# Altium schematic sheet MY_beamControl_R_对内接口.SchDoc
size A2; PageSetup: Record=PageOptions?CenterHorizontal=True?CenterVertical=True?PrintScale=0.73?XCorrection=1.00?YCorrection=1.00?PrintKind=1?BorderSize=5000000?LeftOffset=0?BottomOffset=0?Orientation=2?PaperLength=4200?PaperWidth=2970?Scale=100?PaperSource=7?PrintQuality=-4?MediaType=1?DitherType=10?PaperKind=A3?PrintScaleMode=1
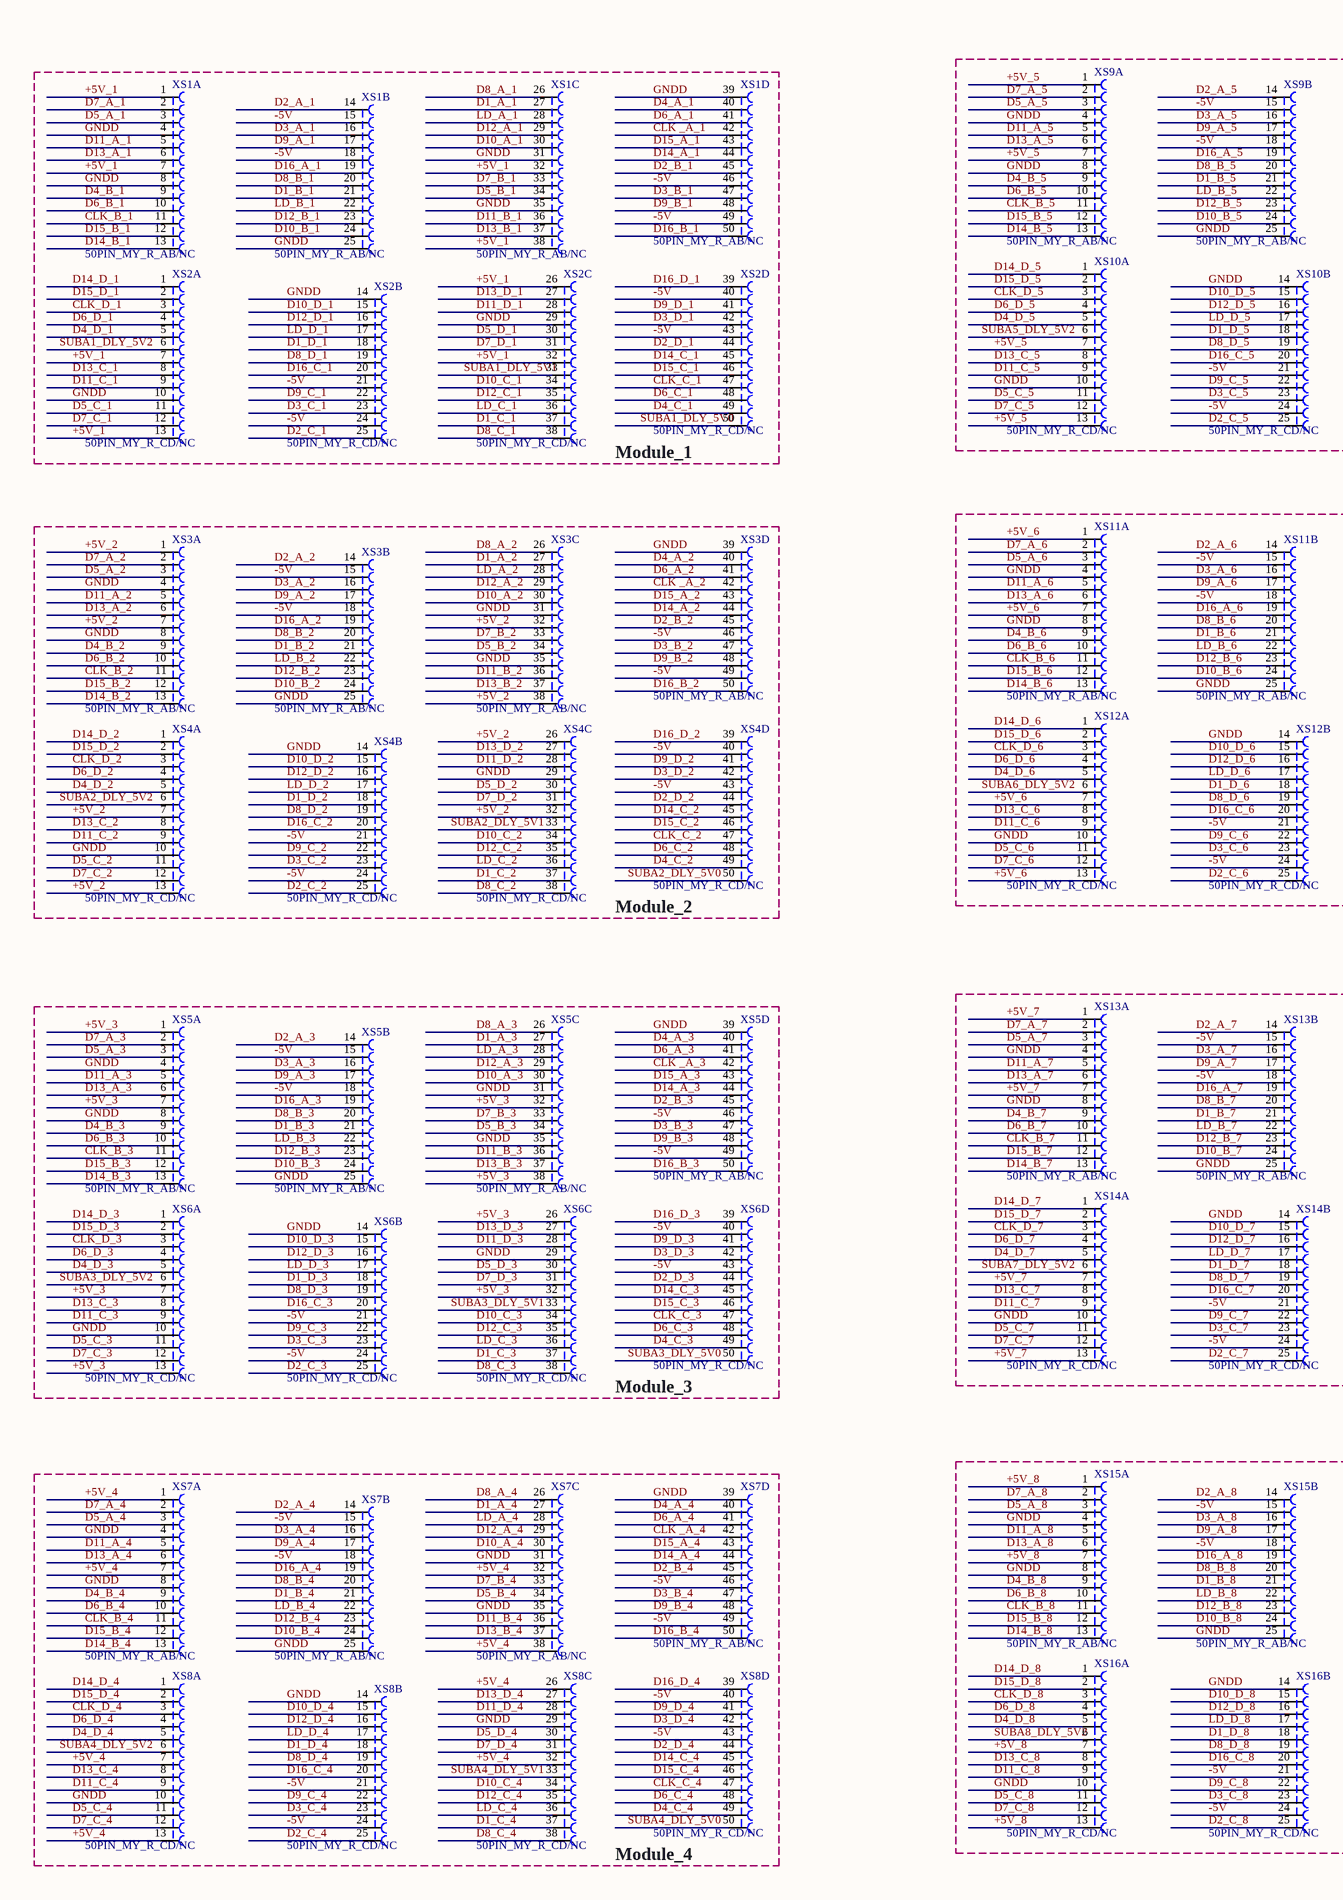
[diagram p0: MY_beamControl_R_对内接口.SchDoc, left]
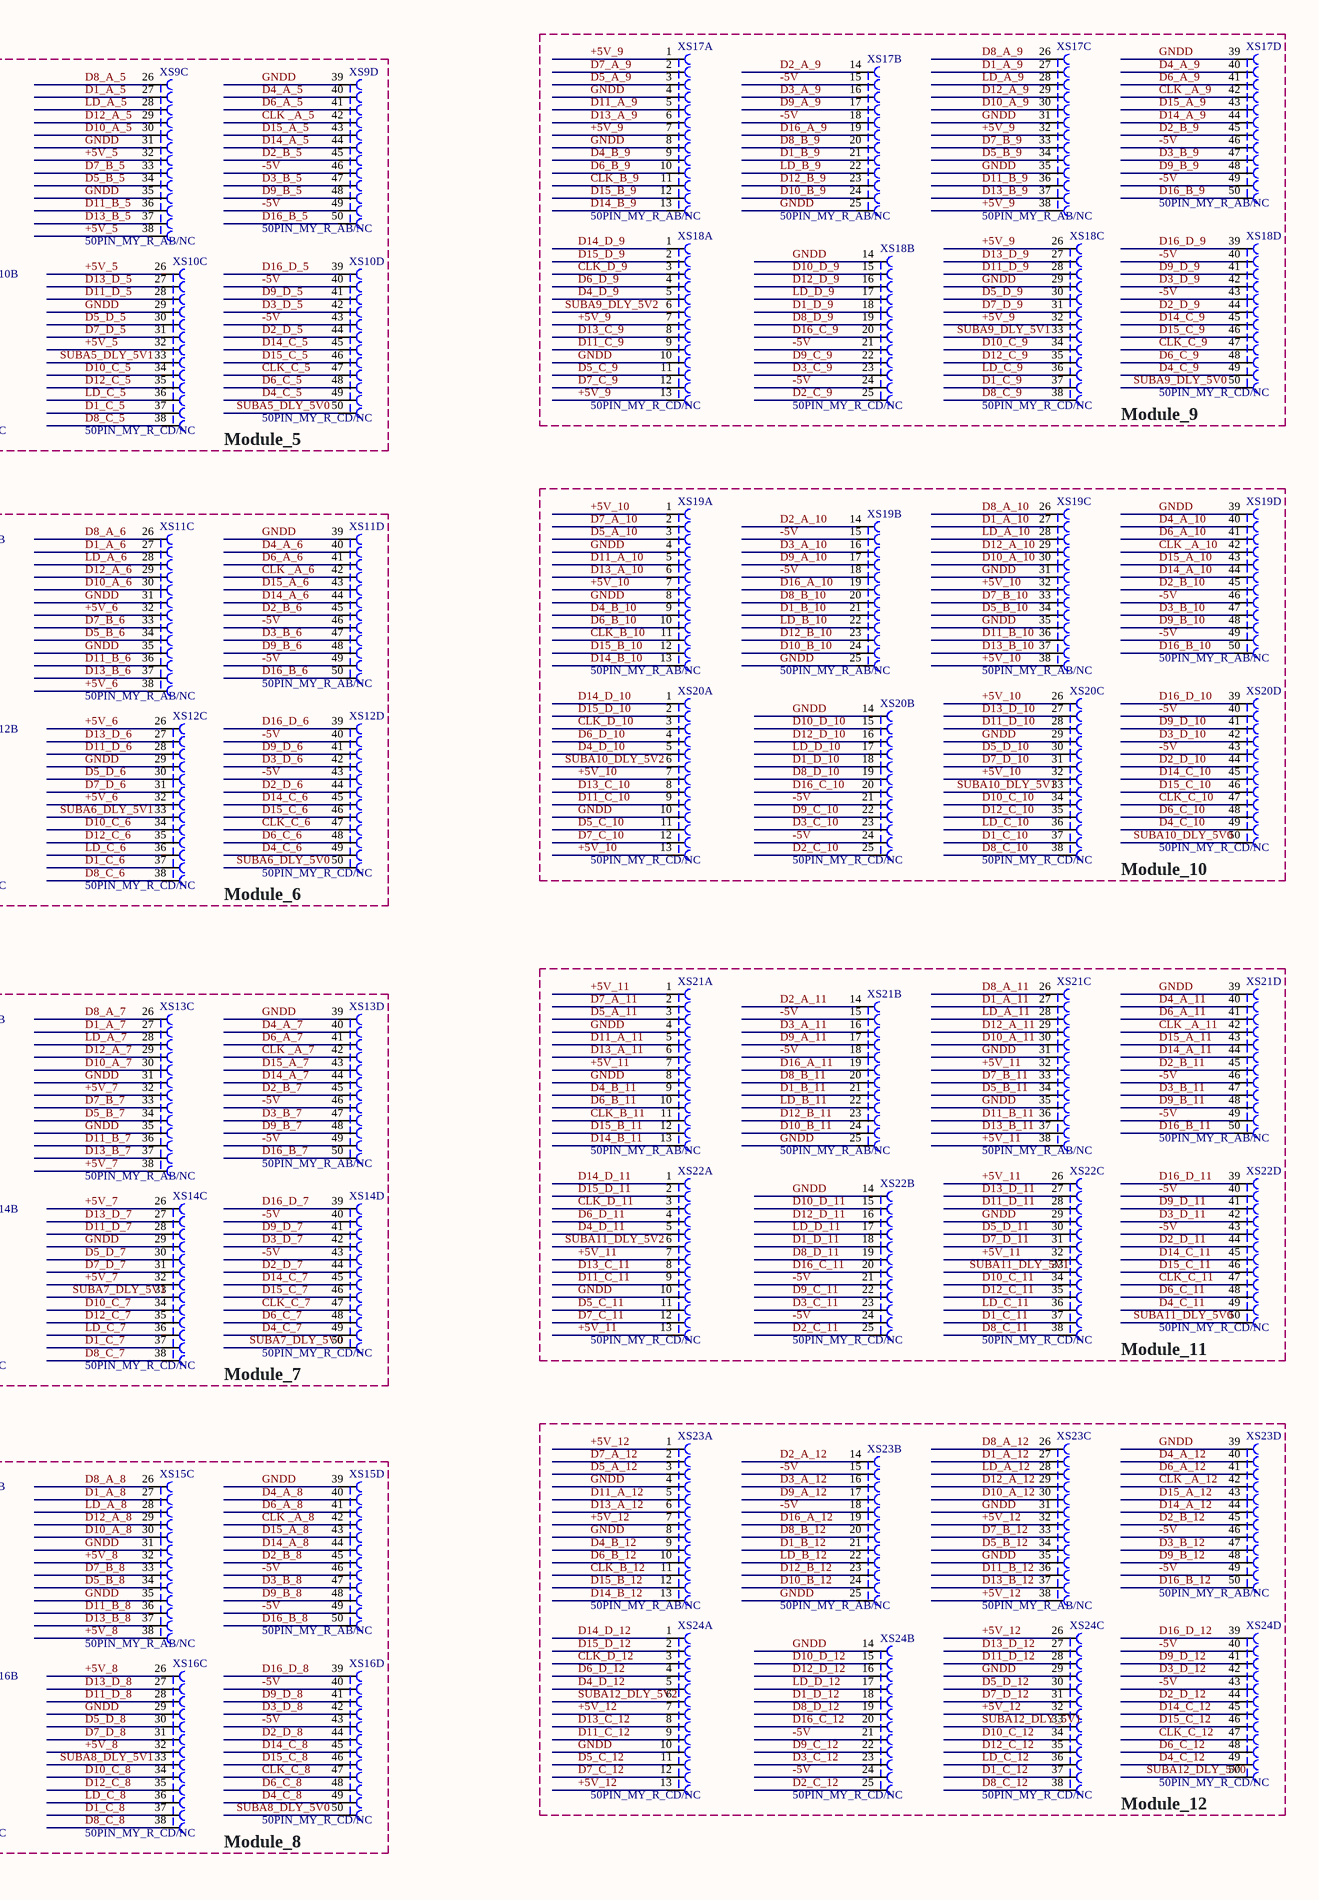
[diagram p1: MY_beamControl_R_对内接口.SchDoc, right]

## Parts
XS1  50PIN_MY_R_AB/NC  [PIN50_MY]  (parts A,B,C,D of 4)
XS2  50PIN_MY_R_CD/NC  [PIN50_MY]  (parts A,B,C,D of 4)
XS3  50PIN_MY_R_AB/NC  [PIN50_MY]  (parts A,B,C,D of 4)
XS4  50PIN_MY_R_CD/NC  [PIN50_MY]  (parts A,B,C,D of 4)
XS5  50PIN_MY_R_AB/NC  [PIN50_MY]  (parts A,B,C,D of 4)
XS6  50PIN_MY_R_CD/NC  [PIN50_MY]  (parts A,B,C,D of 4)
XS7  50PIN_MY_R_AB/NC  [PIN50_MY]  (parts A,B,C,D of 4)
XS8  50PIN_MY_R_CD/NC  [PIN50_MY]  (parts A,B,C,D of 4)
XS9  50PIN_MY_R_AB/NC  [PIN50_MY]  (parts A,B,C,D of 4)
XS10  50PIN_MY_R_CD/NC  [PIN50_MY]  (parts A,B,C,D of 4)
XS11  50PIN_MY_R_AB/NC  [PIN50_MY]  (parts A,B,C,D of 4)
XS12  50PIN_MY_R_CD/NC  [PIN50_MY]  (parts A,B,C,D of 4)
XS13  50PIN_MY_R_AB/NC  [PIN50_MY]  (parts A,B,C,D of 4)
XS14  50PIN_MY_R_CD/NC  [PIN50_MY]  (parts A,B,C,D of 4)
XS15  50PIN_MY_R_AB/NC  [PIN50_MY]  (parts A,B,C,D of 4)
XS16  50PIN_MY_R_CD/NC  [PIN50_MY]  (parts A,B,C,D of 4)
XS17  50PIN_MY_R_AB/NC  [PIN50_MY]  (parts A,B,C,D of 4)
XS18  50PIN_MY_R_CD/NC  [PIN50_MY]  (parts A,B,C,D of 4)
XS19  50PIN_MY_R_AB/NC  [PIN50_MY]  (parts A,B,C,D of 4)
XS20  50PIN_MY_R_CD/NC  [PIN50_MY]  (parts A,B,C,D of 4)
XS21  50PIN_MY_R_AB/NC  [PIN50_MY]  (parts A,B,C,D of 4)
XS22  50PIN_MY_R_CD/NC  [PIN50_MY]  (parts A,B,C,D of 4)
XS23  50PIN_MY_R_AB/NC  [PIN50_MY]  (parts A,B,C,D of 4)
XS24  50PIN_MY_R_CD/NC  [PIN50_MY]  (parts A,B,C,D of 4)

## Blocks framed on the sheet
Module_1: XS1 XS2
Module_5: XS9 XS10
Module_9: XS17 XS18
Module_6: XS11 XS12
Module_10: XS19 XS20
Module_2: XS3 XS4
Module_11: XS21 XS22
Module_3: XS5 XS6
Module_7: XS13 XS14
Module_12: XS23 XS24
Module_4: XS7 XS8
Module_8: XS15 XS16

## Nets
+5V_1: XS1.1 XS1.7 XS1.32 XS1.38 XS2.7 XS2.13 XS2.26 XS2.32
+5V_2: XS3.1 XS3.7 XS3.32 XS3.38 XS4.7 XS4.13 XS4.26 XS4.32
+5V_3: XS5.1 XS5.7 XS5.32 XS5.38 XS6.7 XS6.13 XS6.26 XS6.32
+5V_4: XS7.1 XS7.7 XS7.32 XS7.38 XS8.7 XS8.13 XS8.26 XS8.32
+5V_5: XS9.1 XS9.7 XS9.32 XS9.38 XS10.7 XS10.13 XS10.26 XS10.32
+5V_6: XS11.1 XS11.7 XS11.32 XS11.38 XS12.7 XS12.13 XS12.26 XS12.32
+5V_7: XS13.1 XS13.7 XS13.32 XS13.38 XS14.7 XS14.13 XS14.26 XS14.32
+5V_8: XS15.1 XS15.7 XS15.32 XS15.38 XS16.7 XS16.13 XS16.26 XS16.32
+5V_9: XS17.1 XS17.7 XS17.32 XS17.38 XS18.7 XS18.13 XS18.26 XS18.32
+5V_10: XS19.1 XS19.7 XS19.32 XS19.38 XS20.7 XS20.13 XS20.26 XS20.32
+5V_11: XS21.1 XS21.7 XS21.32 XS21.38 XS22.7 XS22.13 XS22.26 XS22.32
+5V_12: XS23.1 XS23.7 XS23.32 XS23.38 XS24.7 XS24.13 XS24.26 XS24.32
-5V: XS1.15 XS1.18 XS1.46 XS1.49 XS2.21 XS2.24 XS2.40 XS2.43 XS3.15 XS3.18 XS3.46 XS3.49 XS4.21 XS4.24 XS4.40 XS4.43 XS5.15 XS5.18 XS5.46 XS5.49 XS6.21 XS6.24 XS6.40 XS6.43 XS7.15 XS7.18 XS7.46 XS7.49 XS8.21 XS8.24 XS8.40 XS8.43 XS9.15 XS9.18 XS9.46 XS9.49 XS10.21 XS10.24 XS10.40 XS10.43 XS11.15 XS11.18 XS11.46 XS11.49 XS12.21 XS12.24 XS12.40 XS12.43 XS13.15 XS13.18 XS13.46 XS13.49 XS14.21 XS14.24 XS14.40 XS14.43 XS15.15 XS15.18 XS15.46 XS15.49 XS16.21 XS16.24 XS16.40 XS16.43 XS17.15 XS17.18 XS17.46 XS17.49 XS18.21 XS18.24 XS18.40 XS18.43 XS19.15 XS19.18 XS19.46 XS19.49 XS20.21 XS20.24 XS20.40 XS20.43 XS21.15 XS21.18 XS21.46 XS21.49 XS22.21 XS22.24 XS22.40 XS22.43 XS23.15 XS23.18 XS23.46 XS23.49 XS24.21 XS24.24 XS24.40 XS24.43
CLK _A_1: XS1.42
CLK _A_2: XS3.42
CLK _A_3: XS5.42
CLK _A_4: XS7.42
CLK _A_5: XS9.42
CLK _A_6: XS11.42
CLK _A_7: XS13.42
CLK _A_8: XS15.42
CLK _A_9: XS17.42
CLK _A_10: XS19.42
CLK _A_11: XS21.42
CLK _A_12: XS23.42
CLK_B_1: XS1.11
CLK_B_2: XS3.11
CLK_B_3: XS5.11
CLK_B_4: XS7.11
CLK_B_5: XS9.11
CLK_B_6: XS11.11
CLK_B_7: XS13.11
CLK_B_8: XS15.11
CLK_B_9: XS17.11
CLK_B_10: XS19.11
CLK_B_11: XS21.11
CLK_B_12: XS23.11
CLK_C_1: XS2.47
CLK_C_2: XS4.47
CLK_C_3: XS6.47
CLK_C_4: XS8.47
CLK_C_5: XS10.47
CLK_C_6: XS12.47
CLK_C_7: XS14.47
CLK_C_8: XS16.47
CLK_C_9: XS18.47
CLK_C_10: XS20.47
CLK_C_11: XS22.47
CLK_C_12: XS24.47
CLK_D_1: XS2.3
CLK_D_2: XS4.3
CLK_D_3: XS6.3
CLK_D_4: XS8.3
CLK_D_5: XS10.3
CLK_D_6: XS12.3
CLK_D_7: XS14.3
CLK_D_8: XS16.3
CLK_D_9: XS18.3
CLK_D_10: XS20.3
CLK_D_11: XS22.3
CLK_D_12: XS24.3
D1_A_1: XS1.27
D1_A_2: XS3.27
D1_A_3: XS5.27
D1_A_4: XS7.27
D1_A_5: XS9.27
D1_A_6: XS11.27
D1_A_7: XS13.27
D1_A_8: XS15.27
D1_A_9: XS17.27
D1_A_10: XS19.27
D1_A_11: XS21.27
D1_A_12: XS23.27
D1_B_1: XS1.21
D1_B_2: XS3.21
D1_B_3: XS5.21
D1_B_4: XS7.21
D1_B_5: XS9.21
D1_B_6: XS11.21
D1_B_7: XS13.21
D1_B_8: XS15.21
D1_B_9: XS17.21
D1_B_10: XS19.21
D1_B_11: XS21.21
D1_B_12: XS23.21
D1_C_1: XS2.37
D1_C_2: XS4.37
D1_C_3: XS6.37
D1_C_4: XS8.37
D1_C_5: XS10.37
D1_C_6: XS12.37
D1_C_7: XS14.37
D1_C_8: XS16.37
D1_C_9: XS18.37
D1_C_10: XS20.37
D1_C_11: XS22.37
D1_C_12: XS24.37
D1_D_1: XS2.18
D1_D_2: XS4.18
D1_D_3: XS6.18
D1_D_4: XS8.18
D1_D_5: XS10.18
D1_D_6: XS12.18
D1_D_7: XS14.18
D1_D_8: XS16.18
D1_D_9: XS18.18
D1_D_10: XS20.18
D1_D_11: XS22.18
D1_D_12: XS24.18
D2_A_1: XS1.14
D2_A_2: XS3.14
D2_A_3: XS5.14
D2_A_4: XS7.14
D2_A_5: XS9.14
D2_A_6: XS11.14
D2_A_7: XS13.14
D2_A_8: XS15.14
D2_A_9: XS17.14
D2_A_10: XS19.14
D2_A_11: XS21.14
D2_A_12: XS23.14
D2_B_1: XS1.45
D2_B_2: XS3.45
D2_B_3: XS5.45
D2_B_4: XS7.45
D2_B_5: XS9.45
D2_B_6: XS11.45
D2_B_7: XS13.45
D2_B_8: XS15.45
D2_B_9: XS17.45
D2_B_10: XS19.45
D2_B_11: XS21.45
D2_B_12: XS23.45
D2_C_1: XS2.25
D2_C_2: XS4.25
D2_C_3: XS6.25
D2_C_4: XS8.25
D2_C_5: XS10.25
D2_C_6: XS12.25
D2_C_7: XS14.25
D2_C_8: XS16.25
D2_C_9: XS18.25
D2_C_10: XS20.25
D2_C_11: XS22.25
D2_C_12: XS24.25
D2_D_1: XS2.44
D2_D_2: XS4.44
D2_D_3: XS6.44
D2_D_4: XS8.44
D2_D_5: XS10.44
D2_D_6: XS12.44
D2_D_7: XS14.44
D2_D_8: XS16.44
D2_D_9: XS18.44
D2_D_10: XS20.44
D2_D_11: XS22.44
D2_D_12: XS24.44
D3_A_1: XS1.16
D3_A_2: XS3.16
D3_A_3: XS5.16
D3_A_4: XS7.16
D3_A_5: XS9.16
D3_A_6: XS11.16
D3_A_7: XS13.16
D3_A_8: XS15.16
D3_A_9: XS17.16
D3_A_10: XS19.16
D3_A_11: XS21.16
D3_A_12: XS23.16
D3_B_1: XS1.47
D3_B_2: XS3.47
D3_B_3: XS5.47
D3_B_4: XS7.47
D3_B_5: XS9.47
D3_B_6: XS11.47
D3_B_7: XS13.47
D3_B_8: XS15.47
D3_B_9: XS17.47
D3_B_10: XS19.47
D3_B_11: XS21.47
D3_B_12: XS23.47
D3_C_1: XS2.23
D3_C_2: XS4.23
D3_C_3: XS6.23
D3_C_4: XS8.23
D3_C_5: XS10.23
D3_C_6: XS12.23
D3_C_7: XS14.23
D3_C_8: XS16.23
D3_C_9: XS18.23
D3_C_10: XS20.23
D3_C_11: XS22.23
D3_C_12: XS24.23
D3_D_1: XS2.42
D3_D_2: XS4.42
D3_D_3: XS6.42
D3_D_4: XS8.42
D3_D_5: XS10.42
D3_D_6: XS12.42
D3_D_7: XS14.42
D3_D_8: XS16.42
D3_D_9: XS18.42
D3_D_10: XS20.42
D3_D_11: XS22.42
D3_D_12: XS24.42
D4_A_1: XS1.40
D4_A_2: XS3.40
D4_A_3: XS5.40
D4_A_4: XS7.40
D4_A_5: XS9.40
D4_A_6: XS11.40
D4_A_7: XS13.40
D4_A_8: XS15.40
D4_A_9: XS17.40
D4_A_10: XS19.40
D4_A_11: XS21.40
D4_A_12: XS23.40
D4_B_1: XS1.9
D4_B_2: XS3.9
D4_B_3: XS5.9
D4_B_4: XS7.9
D4_B_5: XS9.9
D4_B_6: XS11.9
D4_B_7: XS13.9
D4_B_8: XS15.9
D4_B_9: XS17.9
D4_B_10: XS19.9
D4_B_11: XS21.9
D4_B_12: XS23.9
D4_C_1: XS2.49
D4_C_2: XS4.49
D4_C_3: XS6.49
D4_C_4: XS8.49
D4_C_5: XS10.49
D4_C_6: XS12.49
D4_C_7: XS14.49
D4_C_8: XS16.49
D4_C_9: XS18.49
D4_C_10: XS20.49
D4_C_11: XS22.49
D4_C_12: XS24.49
D4_D_1: XS2.5
D4_D_2: XS4.5
D4_D_3: XS6.5
D4_D_4: XS8.5
D4_D_5: XS10.5
D4_D_6: XS12.5
D4_D_7: XS14.5
D4_D_8: XS16.5
D4_D_9: XS18.5
D4_D_10: XS20.5
D4_D_11: XS22.5
D4_D_12: XS24.5
D5_A_1: XS1.3
D5_A_2: XS3.3
D5_A_3: XS5.3
D5_A_4: XS7.3
D5_A_5: XS9.3
D5_A_6: XS11.3
D5_A_7: XS13.3
D5_A_8: XS15.3
D5_A_9: XS17.3
D5_A_10: XS19.3
D5_A_11: XS21.3
D5_A_12: XS23.3
D5_B_1: XS1.34
D5_B_2: XS3.34
D5_B_3: XS5.34
D5_B_4: XS7.34
D5_B_5: XS9.34
D5_B_6: XS11.34
D5_B_7: XS13.34
D5_B_8: XS15.34
D5_B_9: XS17.34
D5_B_10: XS19.34
D5_B_11: XS21.34
D5_B_12: XS23.34
D5_C_1: XS2.11
D5_C_2: XS4.11
D5_C_3: XS6.11
D5_C_4: XS8.11
D5_C_5: XS10.11
D5_C_6: XS12.11
D5_C_7: XS14.11
D5_C_8: XS16.11
D5_C_9: XS18.11
D5_C_10: XS20.11
D5_C_11: XS22.11
D5_C_12: XS24.11
D5_D_1: XS2.30
D5_D_2: XS4.30
D5_D_3: XS6.30
D5_D_4: XS8.30
D5_D_5: XS10.30
D5_D_6: XS12.30
D5_D_7: XS14.30
D5_D_8: XS16.30
D5_D_9: XS18.30
D5_D_10: XS20.30
D5_D_11: XS22.30
D5_D_12: XS24.30
D6_A_1: XS1.41
D6_A_2: XS3.41
D6_A_3: XS5.41
D6_A_4: XS7.41
D6_A_5: XS9.41
D6_A_6: XS11.41
D6_A_7: XS13.41
D6_A_8: XS15.41
D6_A_9: XS17.41
D6_A_10: XS19.41
D6_A_11: XS21.41
D6_A_12: XS23.41
D6_B_1: XS1.10
D6_B_2: XS3.10
D6_B_3: XS5.10
D6_B_4: XS7.10
D6_B_5: XS9.10
D6_B_6: XS11.10
D6_B_7: XS13.10
D6_B_8: XS15.10
D6_B_9: XS17.10
D6_B_10: XS19.10
D6_B_11: XS21.10
D6_B_12: XS23.10
D6_C_1: XS2.48
D6_C_2: XS4.48
D6_C_3: XS6.48
D6_C_4: XS8.48
D6_C_5: XS10.48
D6_C_6: XS12.48
D6_C_7: XS14.48
D6_C_8: XS16.48
D6_C_9: XS18.48
D6_C_10: XS20.48
D6_C_11: XS22.48
D6_C_12: XS24.48
D6_D_1: XS2.4
D6_D_2: XS4.4
D6_D_3: XS6.4
D6_D_4: XS8.4
D6_D_5: XS10.4
D6_D_6: XS12.4
D6_D_7: XS14.4
D6_D_8: XS16.4
D6_D_9: XS18.4
D6_D_10: XS20.4
D6_D_11: XS22.4
D6_D_12: XS24.4
D7_A_1: XS1.2
D7_A_2: XS3.2
D7_A_3: XS5.2
D7_A_4: XS7.2
D7_A_5: XS9.2
D7_A_6: XS11.2
D7_A_7: XS13.2
D7_A_8: XS15.2
D7_A_9: XS17.2
D7_A_10: XS19.2
D7_A_11: XS21.2
D7_A_12: XS23.2
D7_B_1: XS1.33
D7_B_2: XS3.33
D7_B_3: XS5.33
D7_B_4: XS7.33
D7_B_5: XS9.33
D7_B_6: XS11.33
D7_B_7: XS13.33
D7_B_8: XS15.33
D7_B_9: XS17.33
D7_B_10: XS19.33
D7_B_11: XS21.33
D7_B_12: XS23.33
D7_C_1: XS2.12
D7_C_2: XS4.12
D7_C_3: XS6.12
D7_C_4: XS8.12
D7_C_5: XS10.12
D7_C_6: XS12.12
D7_C_7: XS14.12
D7_C_8: XS16.12
D7_C_9: XS18.12
D7_C_10: XS20.12
D7_C_11: XS22.12
D7_C_12: XS24.12
D7_D_1: XS2.31
D7_D_2: XS4.31
D7_D_3: XS6.31
D7_D_4: XS8.31
D7_D_5: XS10.31
D7_D_6: XS12.31
D7_D_7: XS14.31
D7_D_8: XS16.31
D7_D_9: XS18.31
D7_D_10: XS20.31
D7_D_11: XS22.31
D7_D_12: XS24.31
D8_A_1: XS1.26
D8_A_2: XS3.26
D8_A_3: XS5.26
D8_A_4: XS7.26
D8_A_5: XS9.26
D8_A_6: XS11.26
D8_A_7: XS13.26
D8_A_8: XS15.26
D8_A_9: XS17.26
D8_A_10: XS19.26
D8_A_11: XS21.26
D8_A_12: XS23.26
D8_B_1: XS1.20
D8_B_2: XS3.20
D8_B_3: XS5.20
D8_B_4: XS7.20
D8_B_5: XS9.20
D8_B_6: XS11.20
D8_B_7: XS13.20
D8_B_8: XS15.20
D8_B_9: XS17.20
D8_B_10: XS19.20
D8_B_11: XS21.20
D8_B_12: XS23.20
D8_C_1: XS2.38
D8_C_2: XS4.38
D8_C_3: XS6.38
D8_C_4: XS8.38
D8_C_5: XS10.38
D8_C_6: XS12.38
D8_C_7: XS14.38
D8_C_8: XS16.38
D8_C_9: XS18.38
D8_C_10: XS20.38
D8_C_11: XS22.38
D8_C_12: XS24.38
D8_D_1: XS2.19
D8_D_2: XS4.19
D8_D_3: XS6.19
D8_D_4: XS8.19
D8_D_5: XS10.19
D8_D_6: XS12.19
D8_D_7: XS14.19
D8_D_8: XS16.19
D8_D_9: XS18.19
D8_D_10: XS20.19
D8_D_11: XS22.19
D8_D_12: XS24.19
D9_A_1: XS1.17
D9_A_2: XS3.17
D9_A_3: XS5.17
D9_A_4: XS7.17
D9_A_5: XS9.17
D9_A_6: XS11.17
D9_A_7: XS13.17
D9_A_8: XS15.17
D9_A_9: XS17.17
D9_A_10: XS19.17
D9_A_11: XS21.17
D9_A_12: XS23.17
D9_B_1: XS1.48
D9_B_2: XS3.48
D9_B_3: XS5.48
D9_B_4: XS7.48
D9_B_5: XS9.48
D9_B_6: XS11.48
D9_B_7: XS13.48
D9_B_8: XS15.48
D9_B_9: XS17.48
D9_B_10: XS19.48
D9_B_11: XS21.48
D9_B_12: XS23.48
D9_C_1: XS2.22
D9_C_2: XS4.22
D9_C_3: XS6.22
D9_C_4: XS8.22
D9_C_5: XS10.22
D9_C_6: XS12.22
D9_C_7: XS14.22
D9_C_8: XS16.22
D9_C_9: XS18.22
D9_C_10: XS20.22
D9_C_11: XS22.22
D9_C_12: XS24.22
D9_D_1: XS2.41
D9_D_2: XS4.41
D9_D_3: XS6.41
D9_D_4: XS8.41
D9_D_5: XS10.41
D9_D_6: XS12.41
D9_D_7: XS14.41
D9_D_8: XS16.41
D9_D_9: XS18.41
D9_D_10: XS20.41
D9_D_11: XS22.41
D9_D_12: XS24.41
D10_A_1: XS1.30
D10_A_2: XS3.30
D10_A_3: XS5.30
D10_A_4: XS7.30
D10_A_5: XS9.30
D10_A_6: XS11.30
D10_A_7: XS13.30
D10_A_8: XS15.30
D10_A_9: XS17.30
D10_A_10: XS19.30
D10_A_11: XS21.30
D10_A_12: XS23.30
D10_B_1: XS1.24
D10_B_2: XS3.24
D10_B_3: XS5.24
D10_B_4: XS7.24
D10_B_5: XS9.24
D10_B_6: XS11.24
D10_B_7: XS13.24
D10_B_8: XS15.24
D10_B_9: XS17.24
D10_B_10: XS19.24
D10_B_11: XS21.24
D10_B_12: XS23.24
D10_C_1: XS2.34
D10_C_2: XS4.34
D10_C_3: XS6.34
D10_C_4: XS8.34
D10_C_5: XS10.34
D10_C_6: XS12.34
D10_C_7: XS14.34
D10_C_8: XS16.34
D10_C_9: XS18.34
D10_C_10: XS20.34
D10_C_11: XS22.34
D10_C_12: XS24.34
D10_D_1: XS2.15
D10_D_2: XS4.15
D10_D_3: XS6.15
D10_D_4: XS8.15
D10_D_5: XS10.15
D10_D_6: XS12.15
D10_D_7: XS14.15
D10_D_8: XS16.15
D10_D_9: XS18.15
D10_D_10: XS20.15
D10_D_11: XS22.15
D10_D_12: XS24.15
D11_A_1: XS1.5
D11_A_2: XS3.5
D11_A_3: XS5.5
D11_A_4: XS7.5
D11_A_5: XS9.5
D11_A_6: XS11.5
D11_A_7: XS13.5
D11_A_8: XS15.5
D11_A_9: XS17.5
D11_A_10: XS19.5
D11_A_11: XS21.5
D11_A_12: XS23.5
D11_B_1: XS1.36
D11_B_2: XS3.36
D11_B_3: XS5.36
D11_B_4: XS7.36
D11_B_5: XS9.36
D11_B_6: XS11.36
D11_B_7: XS13.36
D11_B_8: XS15.36
D11_B_9: XS17.36
D11_B_10: XS19.36
D11_B_11: XS21.36
D11_B_12: XS23.36
D11_C_1: XS2.9
D11_C_2: XS4.9
D11_C_3: XS6.9
D11_C_4: XS8.9
D11_C_5: XS10.9
D11_C_6: XS12.9
D11_C_7: XS14.9
D11_C_8: XS16.9
D11_C_9: XS18.9
D11_C_10: XS20.9
D11_C_11: XS22.9
D11_C_12: XS24.9
D11_D_1: XS2.28
D11_D_2: XS4.28
D11_D_3: XS6.28
D11_D_4: XS8.28
D11_D_5: XS10.28
D11_D_6: XS12.28
D11_D_7: XS14.28
D11_D_8: XS16.28
D11_D_9: XS18.28
D11_D_10: XS20.28
D11_D_11: XS22.28
D11_D_12: XS24.28
D12_A_1: XS1.29
D12_A_2: XS3.29
D12_A_3: XS5.29
D12_A_4: XS7.29
D12_A_5: XS9.29
D12_A_6: XS11.29
D12_A_7: XS13.29
D12_A_8: XS15.29
D12_A_9: XS17.29
D12_A_10: XS19.29
D12_A_11: XS21.29
D12_A_12: XS23.29
D12_B_1: XS1.23
D12_B_2: XS3.23
D12_B_3: XS5.23
D12_B_4: XS7.23
D12_B_5: XS9.23
D12_B_6: XS11.23
D12_B_7: XS13.23
D12_B_8: XS15.23
D12_B_9: XS17.23
D12_B_10: XS19.23
D12_B_11: XS21.23
D12_B_12: XS23.23
D12_C_1: XS2.35
D12_C_2: XS4.35
D12_C_3: XS6.35
D12_C_4: XS8.35
D12_C_5: XS10.35
D12_C_6: XS12.35
D12_C_7: XS14.35
D12_C_8: XS16.35
D12_C_9: XS18.35
D12_C_10: XS20.35
D12_C_11: XS22.35
D12_C_12: XS24.35
D12_D_1: XS2.16
D12_D_2: XS4.16
D12_D_3: XS6.16
D12_D_4: XS8.16
D12_D_5: XS10.16
D12_D_6: XS12.16
D12_D_7: XS14.16
D12_D_8: XS16.16
D12_D_9: XS18.16
D12_D_10: XS20.16
D12_D_11: XS22.16
D12_D_12: XS24.16
D13_A_1: XS1.6
D13_A_2: XS3.6
D13_A_3: XS5.6
D13_A_4: XS7.6
D13_A_5: XS9.6
D13_A_6: XS11.6
D13_A_7: XS13.6
D13_A_8: XS15.6
D13_A_9: XS17.6
D13_A_10: XS19.6
D13_A_11: XS21.6
D13_A_12: XS23.6
D13_B_1: XS1.37
D13_B_2: XS3.37
D13_B_3: XS5.37
D13_B_4: XS7.37
D13_B_5: XS9.37
D13_B_6: XS11.37
D13_B_7: XS13.37
D13_B_8: XS15.37
D13_B_9: XS17.37
D13_B_10: XS19.37
D13_B_11: XS21.37
D13_B_12: XS23.37
D13_C_1: XS2.8
D13_C_2: XS4.8
D13_C_3: XS6.8
D13_C_4: XS8.8
D13_C_5: XS10.8
D13_C_6: XS12.8
D13_C_7: XS14.8
D13_C_8: XS16.8
D13_C_9: XS18.8
D13_C_10: XS20.8
D13_C_11: XS22.8
D13_C_12: XS24.8
D13_D_1: XS2.27
D13_D_2: XS4.27
D13_D_3: XS6.27
D13_D_4: XS8.27
D13_D_5: XS10.27
D13_D_6: XS12.27
D13_D_7: XS14.27
D13_D_8: XS16.27
D13_D_9: XS18.27
D13_D_10: XS20.27
D13_D_11: XS22.27
D13_D_12: XS24.27
D14_A_1: XS1.44
D14_A_2: XS3.44
D14_A_3: XS5.44
D14_A_4: XS7.44
D14_A_5: XS9.44
D14_A_6: XS11.44
D14_A_7: XS13.44
D14_A_8: XS15.44
D14_A_9: XS17.44
D14_A_10: XS19.44
D14_A_11: XS21.44
D14_A_12: XS23.44
D14_B_1: XS1.13
D14_B_2: XS3.13
D14_B_3: XS5.13
D14_B_4: XS7.13
D14_B_5: XS9.13
D14_B_6: XS11.13
D14_B_7: XS13.13
D14_B_8: XS15.13
D14_B_9: XS17.13
D14_B_10: XS19.13
D14_B_11: XS21.13
D14_B_12: XS23.13
D14_C_1: XS2.45
D14_C_2: XS4.45
D14_C_3: XS6.45
D14_C_4: XS8.45
D14_C_5: XS10.45
D14_C_6: XS12.45
D14_C_7: XS14.45
D14_C_8: XS16.45
D14_C_9: XS18.45
D14_C_10: XS20.45
D14_C_11: XS22.45
D14_C_12: XS24.45
D14_D_1: XS2.1
D14_D_2: XS4.1
D14_D_3: XS6.1
D14_D_4: XS8.1
D14_D_5: XS10.1
D14_D_6: XS12.1
D14_D_7: XS14.1
D14_D_8: XS16.1
D14_D_9: XS18.1
D14_D_10: XS20.1
D14_D_11: XS22.1
D14_D_12: XS24.1
D15_A_1: XS1.43
D15_A_2: XS3.43
D15_A_3: XS5.43
D15_A_4: XS7.43
D15_A_5: XS9.43
D15_A_6: XS11.43
D15_A_7: XS13.43
D15_A_8: XS15.43
D15_A_9: XS17.43
D15_A_10: XS19.43
D15_A_11: XS21.43
D15_A_12: XS23.43
D15_B_1: XS1.12
D15_B_2: XS3.12
D15_B_3: XS5.12
D15_B_4: XS7.12
D15_B_5: XS9.12
D15_B_6: XS11.12
D15_B_7: XS13.12
D15_B_8: XS15.12
D15_B_9: XS17.12
D15_B_10: XS19.12
D15_B_11: XS21.12
D15_B_12: XS23.12
D15_C_1: XS2.46
D15_C_2: XS4.46
D15_C_3: XS6.46
D15_C_4: XS8.46
D15_C_5: XS10.46
D15_C_6: XS12.46
D15_C_7: XS14.46
D15_C_8: XS16.46
D15_C_9: XS18.46
D15_C_10: XS20.46
D15_C_11: XS22.46
D15_C_12: XS24.46
D15_D_1: XS2.2
D15_D_2: XS4.2
D15_D_3: XS6.2
D15_D_4: XS8.2
D15_D_5: XS10.2
D15_D_6: XS12.2
D15_D_7: XS14.2
D15_D_8: XS16.2
D15_D_9: XS18.2
D15_D_10: XS20.2
D15_D_11: XS22.2
D15_D_12: XS24.2
D16_A_1: XS1.19
D16_A_2: XS3.19
D16_A_3: XS5.19
D16_A_4: XS7.19
D16_A_5: XS9.19
D16_A_6: XS11.19
D16_A_7: XS13.19
D16_A_8: XS15.19
D16_A_9: XS17.19
D16_A_10: XS19.19
D16_A_11: XS21.19
D16_A_12: XS23.19
D16_B_1: XS1.50
D16_B_2: XS3.50
D16_B_3: XS5.50
D16_B_4: XS7.50
D16_B_5: XS9.50
D16_B_6: XS11.50
D16_B_7: XS13.50
D16_B_8: XS15.50
D16_B_9: XS17.50
D16_B_10: XS19.50
D16_B_11: XS21.50
D16_B_12: XS23.50
D16_C_1: XS2.20
D16_C_2: XS4.20
D16_C_3: XS6.20
D16_C_4: XS8.20
D16_C_5: XS10.20
D16_C_6: XS12.20
D16_C_7: XS14.20
D16_C_8: XS16.20
D16_C_9: XS18.20
D16_C_10: XS20.20
D16_C_11: XS22.20
D16_C_12: XS24.20
D16_D_1: XS2.39
D16_D_2: XS4.39
D16_D_3: XS6.39
D16_D_4: XS8.39
D16_D_5: XS10.39
D16_D_6: XS12.39
D16_D_7: XS14.39
D16_D_8: XS16.39
D16_D_9: XS18.39
D16_D_10: XS20.39
D16_D_11: XS22.39
D16_D_12: XS24.39
GNDD: XS1.4 XS1.8 XS1.25 XS1.31 XS1.35 XS1.39 XS2.10 XS2.14 XS2.29 XS3.4 XS3.8 XS3.25 XS3.31 XS3.35 XS3.39 XS4.10 XS4.14 XS4.29 XS5.4 XS5.8 XS5.25 XS5.31 XS5.35 XS5.39 XS6.10 XS6.14 XS6.29 XS7.4 XS7.8 XS7.25 XS7.31 XS7.35 XS7.39 XS8.10 XS8.14 XS8.29 XS9.4 XS9.8 XS9.25 XS9.31 XS9.35 XS9.39 XS10.10 XS10.14 XS10.29 XS11.4 XS11.8 XS11.25 XS11.31 XS11.35 XS11.39 XS12.10 XS12.14 XS12.29 XS13.4 XS13.8 XS13.25 XS13.31 XS13.35 XS13.39 XS14.10 XS14.14 XS14.29 XS15.4 XS15.8 XS15.25 XS15.31 XS15.35 XS15.39 XS16.10 XS16.14 XS16.29 XS17.4 XS17.8 XS17.25 XS17.31 XS17.35 XS17.39 XS18.10 XS18.14 XS18.29 XS19.4 XS19.8 XS19.25 XS19.31 XS19.35 XS19.39 XS20.10 XS20.14 XS20.29 XS21.4 XS21.8 XS21.25 XS21.31 XS21.35 XS21.39 XS22.10 XS22.14 XS22.29 XS23.4 XS23.8 XS23.25 XS23.31 XS23.35 XS23.39 XS24.10 XS24.14 XS24.29
LD_A_1: XS1.28
LD_A_2: XS3.28
LD_A_3: XS5.28
LD_A_4: XS7.28
LD_A_5: XS9.28
LD_A_6: XS11.28
LD_A_7: XS13.28
LD_A_8: XS15.28
LD_A_9: XS17.28
LD_A_10: XS19.28
LD_A_11: XS21.28
LD_A_12: XS23.28
LD_B_1: XS1.22
LD_B_2: XS3.22
LD_B_3: XS5.22
LD_B_4: XS7.22
LD_B_5: XS9.22
LD_B_6: XS11.22
LD_B_7: XS13.22
LD_B_8: XS15.22
LD_B_9: XS17.22
LD_B_10: XS19.22
LD_B_11: XS21.22
LD_B_12: XS23.22
LD_C_1: XS2.36
LD_C_2: XS4.36
LD_C_3: XS6.36
LD_C_4: XS8.36
LD_C_5: XS10.36
LD_C_6: XS12.36
LD_C_7: XS14.36
LD_C_8: XS16.36
LD_C_9: XS18.36
LD_C_10: XS20.36
LD_C_11: XS22.36
LD_C_12: XS24.36
LD_D_1: XS2.17
LD_D_2: XS4.17
LD_D_3: XS6.17
LD_D_4: XS8.17
LD_D_5: XS10.17
LD_D_6: XS12.17
LD_D_7: XS14.17
LD_D_8: XS16.17
LD_D_9: XS18.17
LD_D_10: XS20.17
LD_D_11: XS22.17
LD_D_12: XS24.17
SUBA1_DLY_5V0: XS2.50
SUBA1_DLY_5V1: XS2.33
SUBA1_DLY_5V2: XS2.6
SUBA2_DLY_5V0: XS4.50
SUBA2_DLY_5V1: XS4.33
SUBA2_DLY_5V2: XS4.6
SUBA3_DLY_5V0: XS6.50
SUBA3_DLY_5V1: XS6.33
SUBA3_DLY_5V2: XS6.6
SUBA4_DLY_5V0: XS8.50
SUBA4_DLY_5V1: XS8.33
SUBA4_DLY_5V2: XS8.6
SUBA5_DLY_5V0: XS10.50
SUBA5_DLY_5V1: XS10.33
SUBA5_DLY_5V2: XS10.6
SUBA6_DLY_5V0: XS12.50
SUBA6_DLY_5V1: XS12.33
SUBA6_DLY_5V2: XS12.6
SUBA7_DLY_5V0: XS14.50
SUBA7_DLY_5V1: XS14.33
SUBA7_DLY_5V2: XS14.6
SUBA8_DLY_5V0: XS16.50
SUBA8_DLY_5V1: XS16.33
SUBA8_DLY_5V2: XS16.6
SUBA9_DLY_5V0: XS18.50
SUBA9_DLY_5V1: XS18.33
SUBA9_DLY_5V2: XS18.6
SUBA10_DLY_5V0: XS20.50
SUBA10_DLY_5V1: XS20.33
SUBA10_DLY_5V2: XS20.6
SUBA11_DLY_5V0: XS22.50
SUBA11_DLY_5V1: XS22.33
SUBA11_DLY_5V2: XS22.6
SUBA12_DLY_5V0: XS24.50
SUBA12_DLY_5V1: XS24.33
SUBA12_DLY_5V2: XS24.6

## Library data of the parts
XS1 XS3 XS5 XS7 XS9 XS11 XS13 XS15 XS17 XS19 XS21 XS23 = 50PIN_MY_R_AB
XS2 XS4 XS6 XS8 XS10 XS12 XS14 XS16 XS18 XS20 XS22 XS24 = 50PIN_MY_R_CD